# Altium schematic sheet USB_Module_SchDoc.SchDoc
size A3; SheetNumber: 1; SheetTotal: 1
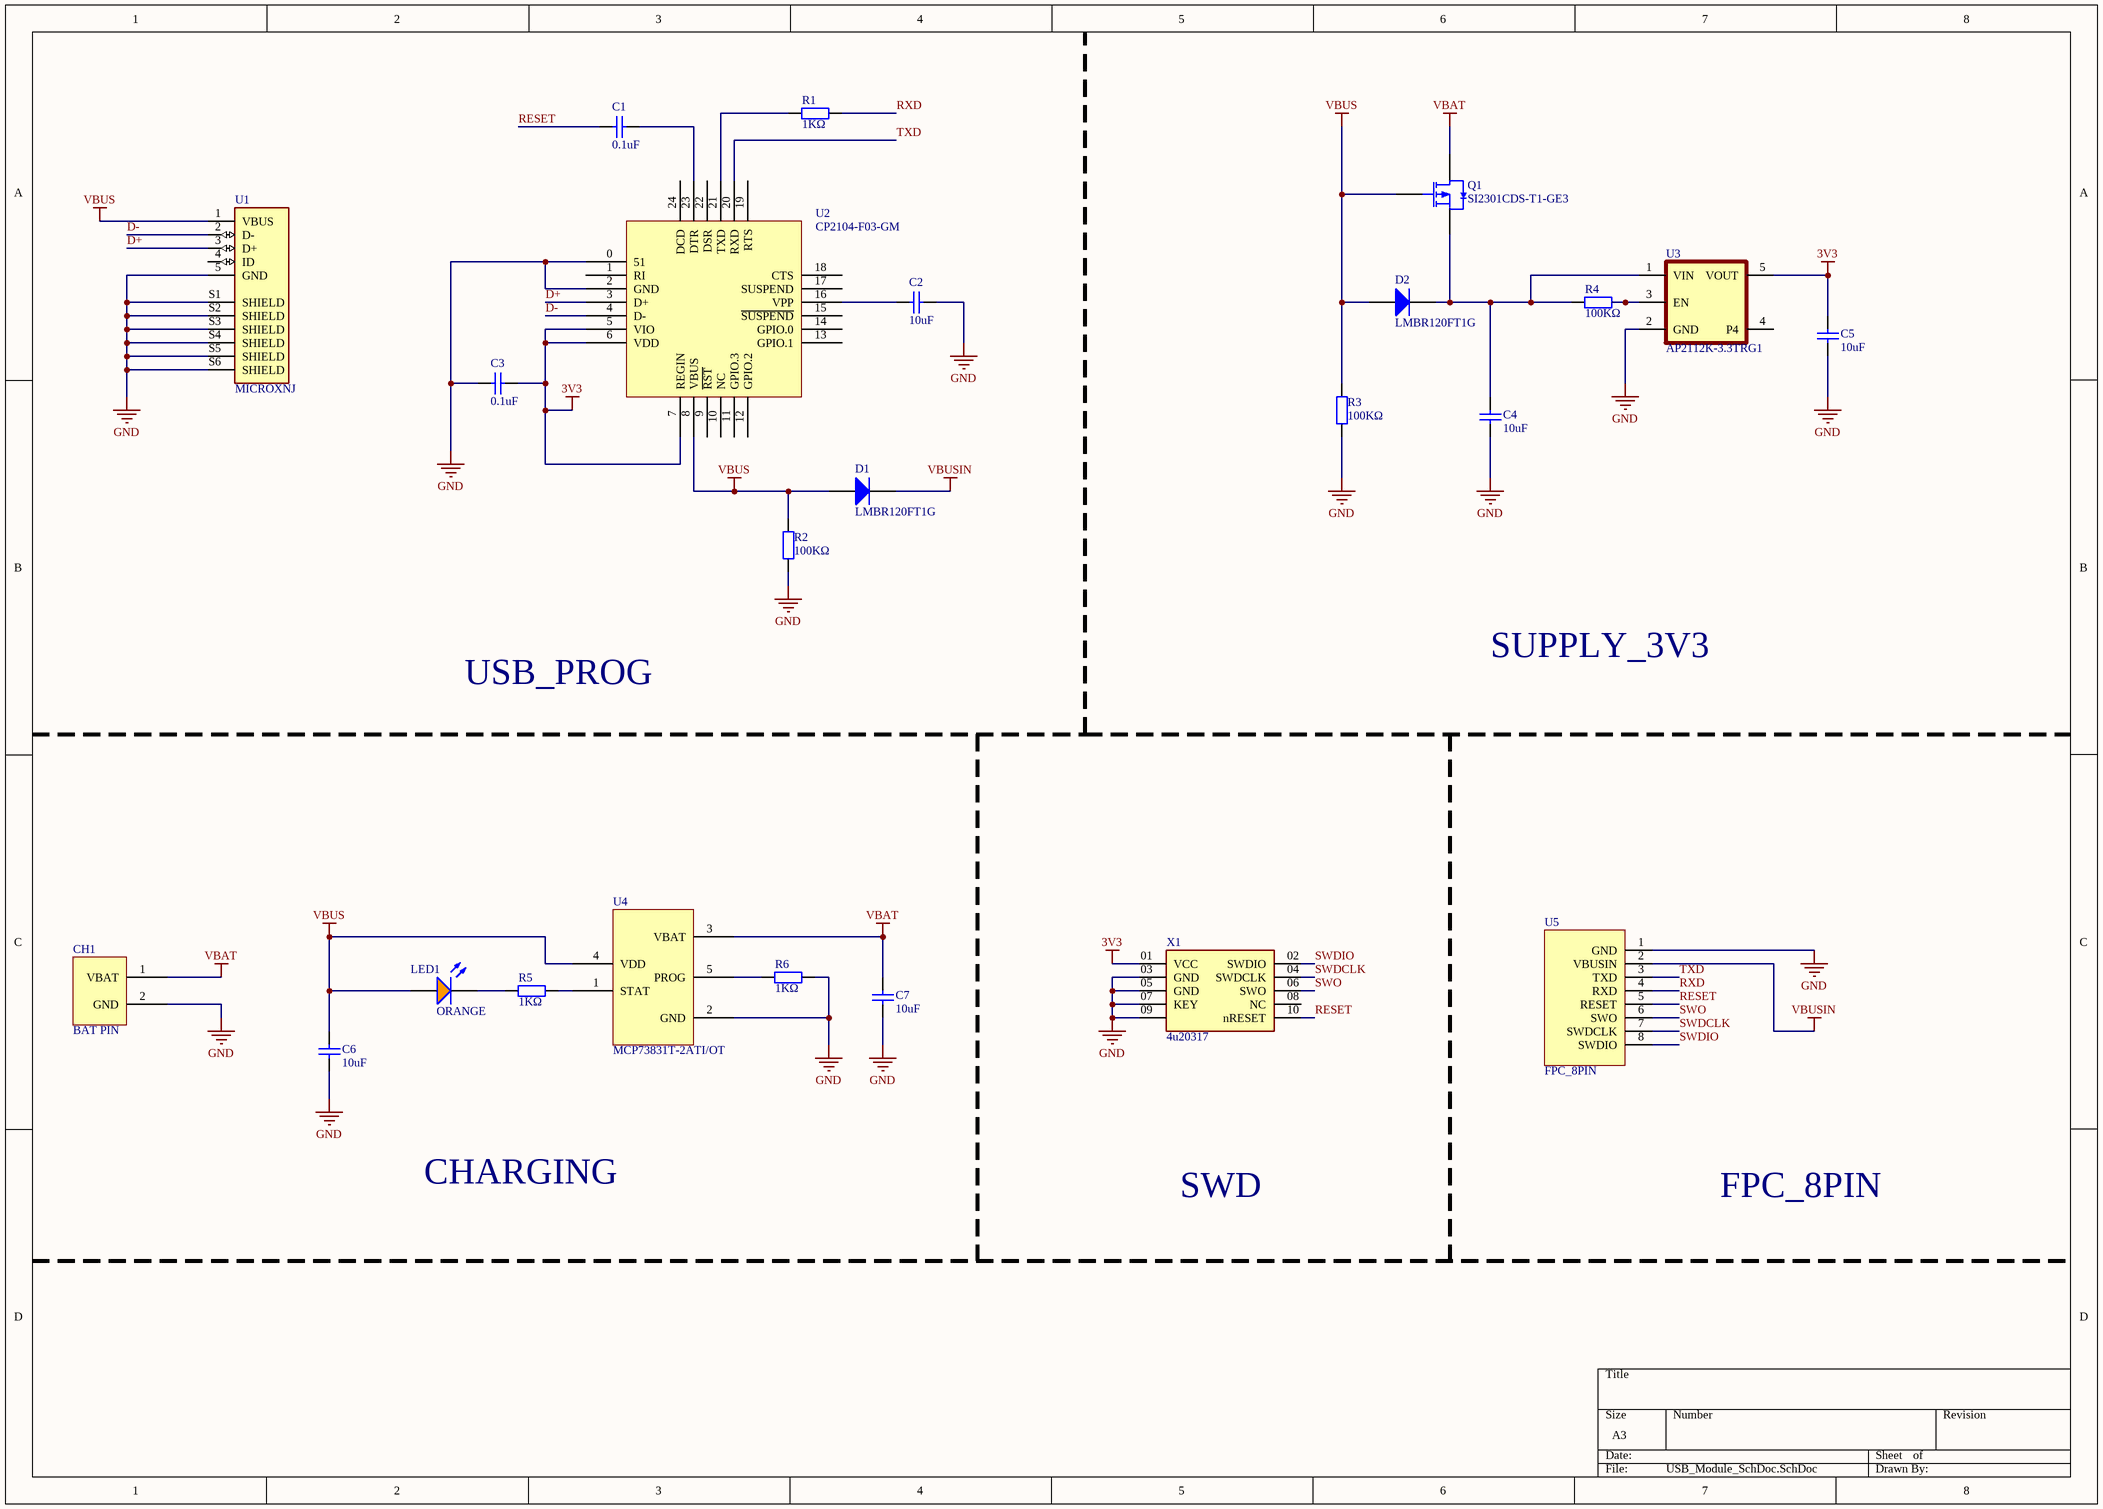
[diagram p0: USB_Module_SchDoc.SchDoc]

## Parts
C1  0.1uF  [0603_C]
C2  10uF  [0805_C]
C3  0.1uF  [0603_C]
C4  10uF  [0805_C]
C5  10uF  [0805_C]
C6  10uF  [0805_C]
C7  10uF  [0805_C]
CH1  BAT PIN  [BAT_MX 1.25-WI-2P]
D1  LMBR120FT1G  [SOD-123]
D2  LMBR120FT1G  [SOD-123]
LED1  ORANGE  [0603_LED_S1]
Q1  SI2301CDS-T1-GE3  [SOT-23(SOT-23-3)]
R1  1KΩ  [0603_R]
R2  100KΩ  [0603_R]
R3  100KΩ  [0603_R]
R4  100KΩ  [0603_R]
R5  1KΩ  [0603_R]
R6  1KΩ  [0603_R]
U1  MICROXNJ  [SHOUHAN_MICROXNJ]
U2  CP2104-F03-GM  [QFN-24_4x4x05P]
U3  AP2112K-3.3TRG1  [SOT95P285X140-5N]
U4  MCP73831T-2ATI/OT  [SOT95P280X145-5N]
U5  FPC_8PIN  [FPC0.5 2H-WS-8P]
X1  4u20317  [TFM-105-12-S-D-A]

## Nets
3V3: C3.2 C5.2 U2.5(VIO) U2.6(VDD) U2.7(REGIN) U3.5(VOUT) X1.01(VCC)
GND: C2.2 C3.1 C4.1 C5.1 C6.1 C7.1 CH1.2(GND) R2.1 R3.1 R6.2 U1.5(GND) U1.S1(SHIELD) U1.S2(SHIELD) U1.S3(SHIELD) U1.S4(SHIELD) U1.S5(SHIELD) U1.S6(SHIELD) U2.0(51) U2.2(GND) U3.2(GND) U4.2(GND) U5.1(GND) X1.03(GND) X1.05(GND) X1.07(KEY) X1.09(GNDDetect)
VBAT: C7.2 CH1.1(VBAT) Q1.3(D) U4.3(VBAT)
VBUS: C6.2 D1.1(A) D2.1(A) LED1.A Q1.1(G) R2.2 R3.2 U1.1(VBUS) U2.8(VBUS) U4.4(VDD)
VBUSIN: D1.2(K) U5.2(VBUSIN)
D+: U1.3(D+) U2.3(D+)
D-: U1.2(D-) U2.4(D-)
RESET: C1.1 U5.5(RESET) X1.10(nRESET)
RXD: R1.2 U5.4(RXD)
SWDCLK: U5.7(SWDCLK) X1.04(SWDCLK)
SWDIO: U5.8(SWDIO) X1.02(SWDIO)
SWO: U5.6(SWO) X1.06(SWO)
TXD: U2.20(RXD) U5.3(TXD)
NetC1_2: C1.2 U2.23(DTR)
NetC2_1: C2.1 U2.16(VPP)
NetC4_2: C4.2 D2.2(K) Q1.2(S) R4.1 U3.1(VIN)
NetLED1_K: LED1.K R5.1
NetR1_1: R1.1 U2.21(TXD)
NetR4_2: R4.2 U3.3(EN)
NetR5_2: R5.2 U4.1(STAT)
NetR6_1: R6.1 U4.5(PROG)

Not connected (* = marked no-connect by the designer): U1 4(ID); U2 1(RI) 9(~{RST}) 10(NC) 11(GPIO.3) 12(GPIO.2) 13(GPIO.1) 14(GPIO.0) 15(~{SUSPEND}) 17(SUSPEND) 18(CTS) 19(RTS) 22(DSR) 24(DCD); U3 4(P4); X1 08(NC)

## Notes on the sheet
- USB_PROG
- SUPPLY_3V3
- CHARGING
- SWD
- FPC_8PIN

## Library data of the parts
C1 C3 = CAP_0.1uF: capacitance
C2 C4-C7 = CAP_10uF: capacitance; ComponentLink1Description: 供应商链接; ComponentLink1URL: http://www.szlcsc.com/product/details_16532.html; Package: 0805; Supplier: LC; SuppliersPartNumber: C15850
CH1 = BAT: button cell battary holder BS-08-B2AA025
D1 D2 = DIO_5: schottky diode; ComponentLink1Description: 供应商链接; ComponentLink1URL: http://www.szlcsc.com/product/details_9093.html; Package: SOD-123; Supplier: LC; SuppliersPartNumber: C8598
LED1 = LED_ORANGE: LED; ComponentLink1Description: 供应商链接; ComponentLink1URL: http://www.szlcsc.com/product/details_2659.html; Package: 0603; Supplier: LC; SuppliersPartNumber: C2286
Q1 = MOS: field effect tube; ComponentLink1Description: 供应商链接; ComponentLink1URL: http://www.szlcsc.com/product/details_11030.html; Package: SOT-23(SOT-23-3); Supplier: LC; SuppliersPartNumber: C10487
R1 R5 R6 = RES_1KΩ: resistance; ComponentLink1Description: 供应商链接; ComponentLink1URL: http://www.szlcsc.com/product/details_26562.html; Package: 0603; Supplier: LC; SuppliersPartNumber: C25819
R2-R4 = RES_100KΩ: resistance; ComponentLink1Description: 供应商链接; ComponentLink1URL: http://www.szlcsc.com/product/details_26562.html; Package: 0603; Supplier: LC; SuppliersPartNumber: C25819
U1 = MICROXNJ: Micro USB
U2 = CP2104: USB chip; ComponentLink1Description: 供应商链接; ComponentLink1URL: http://www.szlcsc.com/product/details_48747.html; Package: QFN-24_4x4x05P; Supplier: LC; SuppliersPartNumber: C47742
U3 = AP2112K: LDO_ low dropout linear regulator
U4 = MCP73831T: Battery power management chip
X1 = JTAG-CORTEXBOXPOSTS: Serial Wire (SW-DP) Connector